# EAGLE design STM32_DAC (EAGLE 9.6.2)

## Sheet 1 of 2
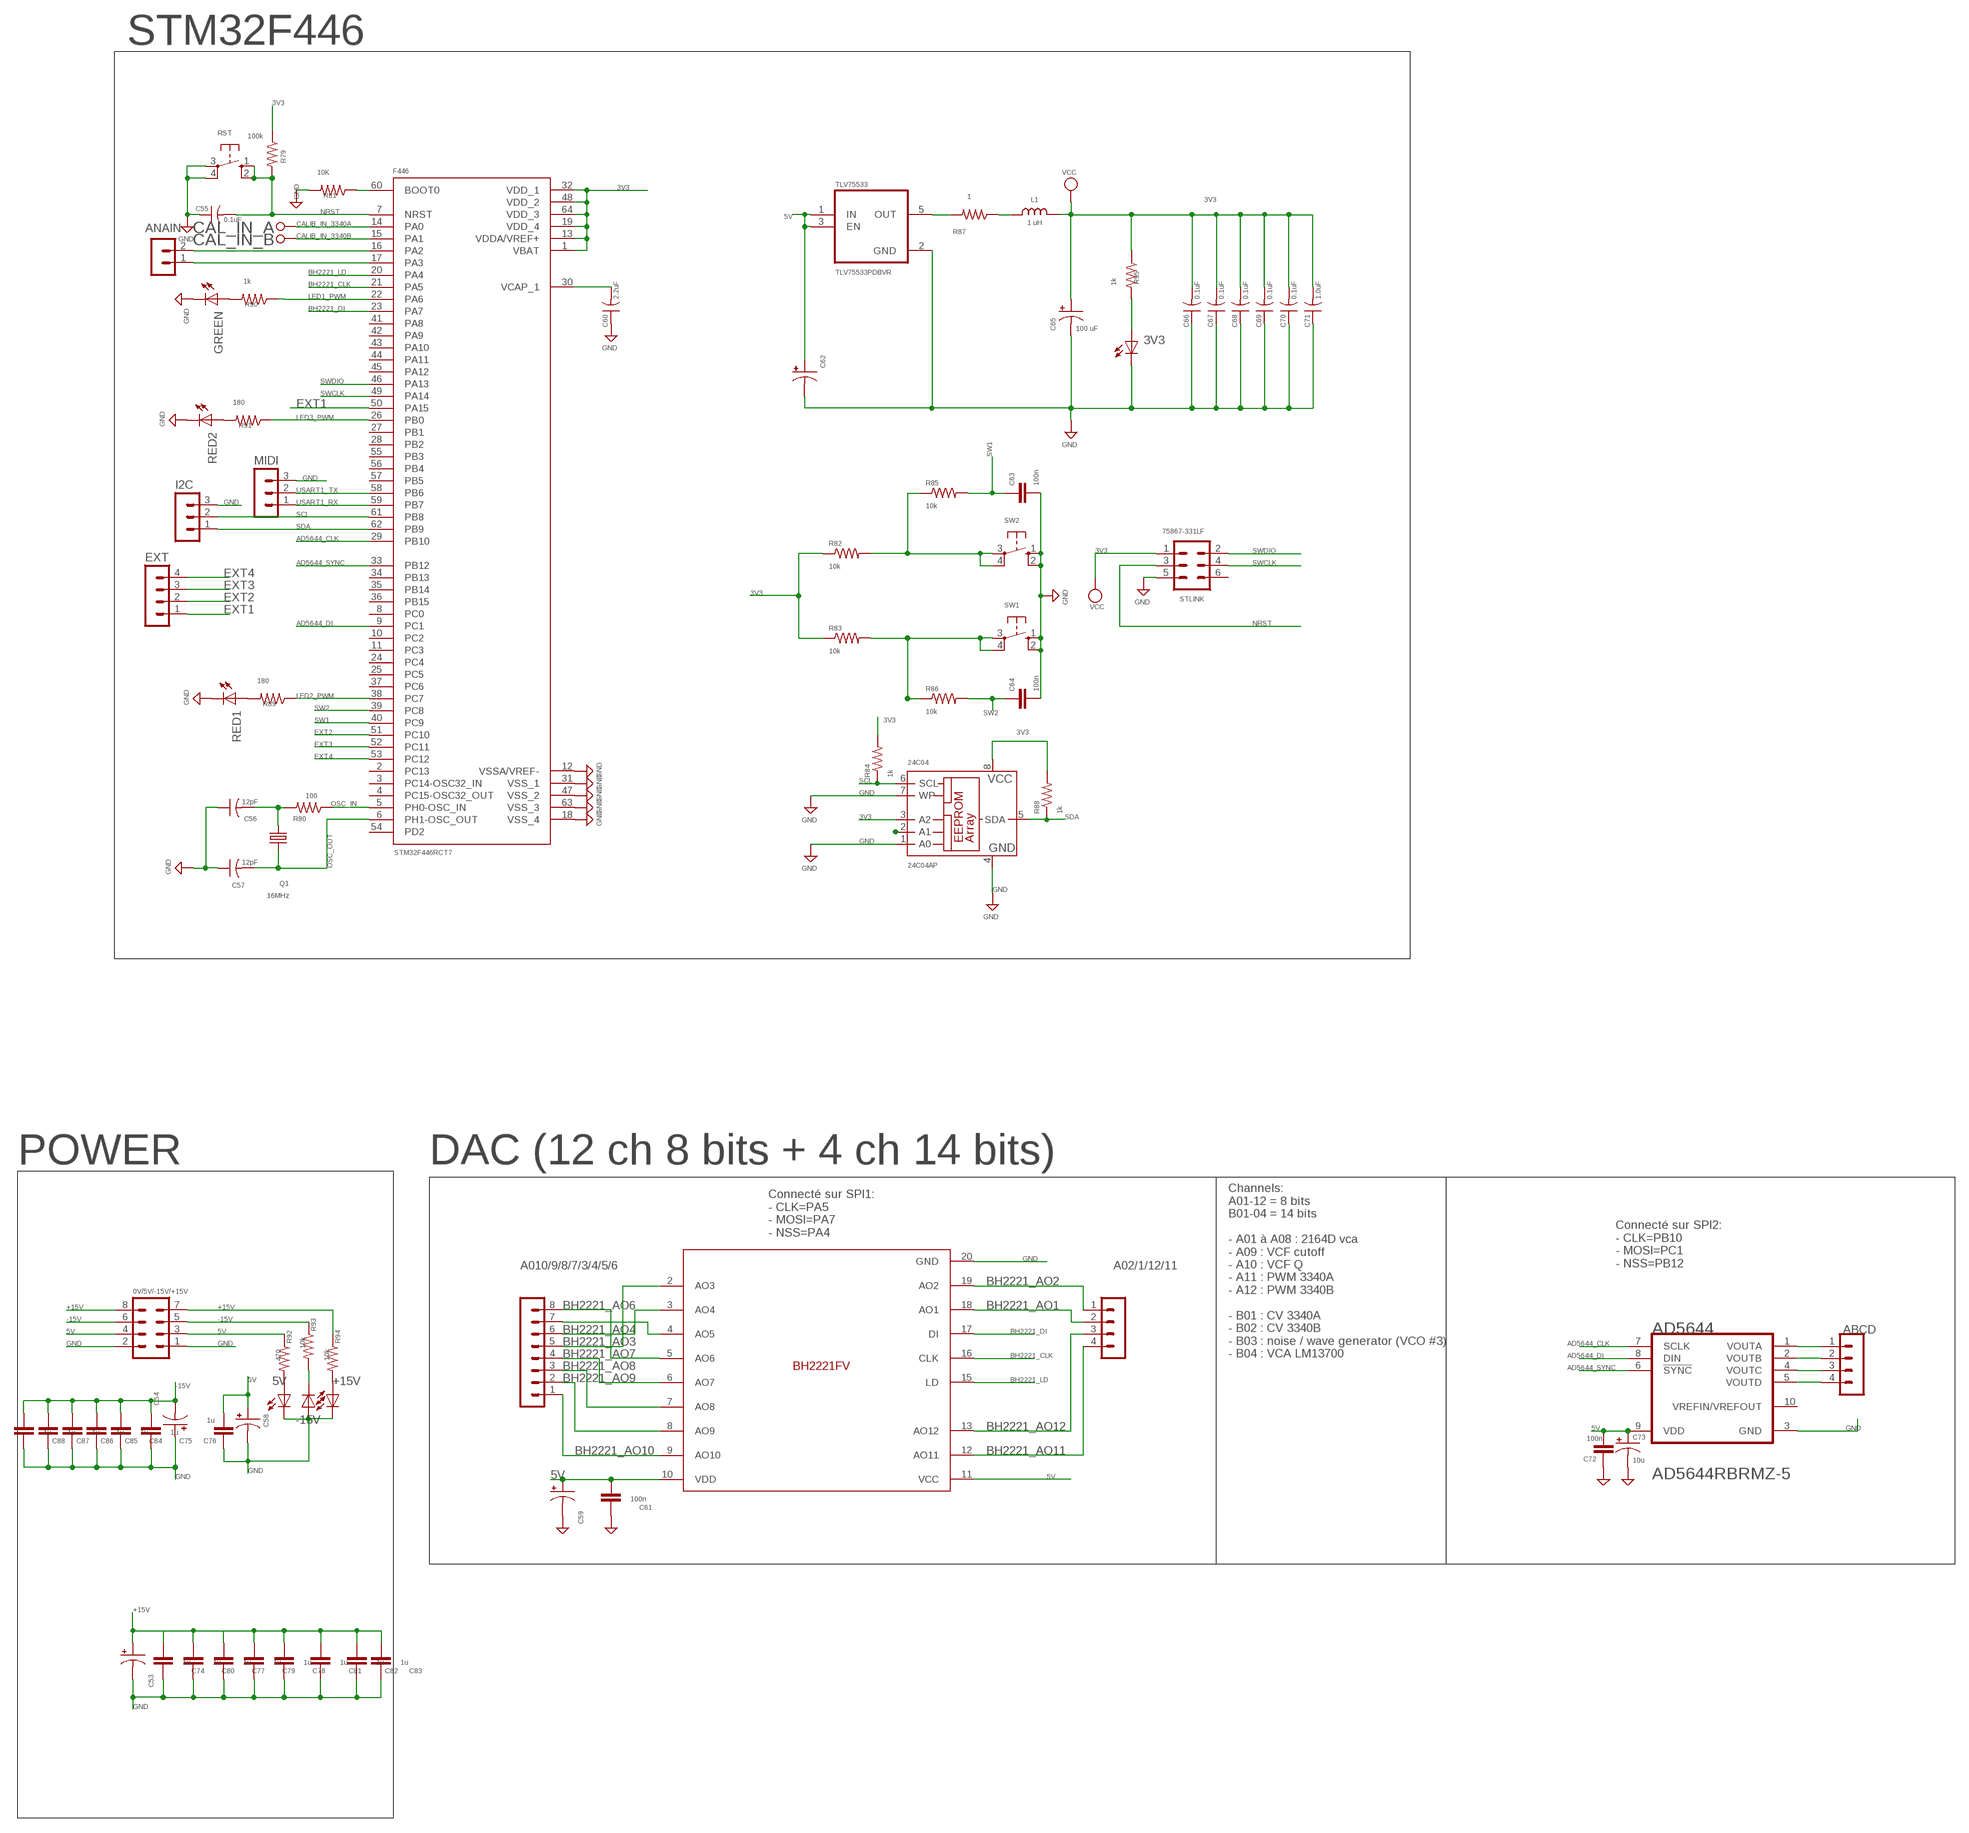
[diagram p0: schematic, sheet 1]

### Parts
0V/5V/-15V/+15V  MA04-2  [MA04-2]
3V3  LED-0805  [0805-LED]
5V  LED-0603  [0603-LED]
24C04  24C04AP  [DIL8]
+15V  LED-0805  [0805-LED]
-15V  LED-0805  [0805-LED]
A02/1/12/11  MA04-1  [MA04-1]
A010/9/8/7/3/4/5/6  MA08-1  [MA08-1]
ABCD  MA04-1  [MA04-1]
AD5644  ANALOG_DEVICES_AD5644RBRMZ-5ANALOG_DEVICES_AD5644RBRMZ-5_0_0  [ANALOG_DEVICES_AD5644RBRMZ-5_0]
ANAIN  MA02-1  [MA02-1]
BH2221  BH2221FV  [SOP65P780X200-20N]
C53  10u  CPOL-US2917  [CPOL2917]
C54  10u  CPOL-US2917  [CPOL2917]
C55  0.1uF  C-US0805  [C0805]
C56  12pF  C-US0805  [C0805]
C57  12pF  C-US0805  [C0805]
C58  10u  CPOL-US2917  [CPOL2917]
C59  10u  CPOL-US2917  [CPOL2917]
C60  2.2uF  C-US0805  [C0805]
C61  100n  C-EUC1206  [C1206]
C62  10u  CPOL-US2917  [CPOL2917]
C63  100n  C-EUC0805  [C0805]
C64  100n  C-EUC0805  [C0805]
C65  100 uF  CPOL-US2917  [CPOL2917]
C66  0.1uF  C-US0805  [C0805]
C67  0.1uF  C-US0805  [C0805]
C68  0.1uF  C-US0805  [C0805]
C69  0.1uF  C-US0805  [C0805]
C70  0.1uF  C-US0805  [C0805]
C71  1.0uF  C-US0805  [C0805]
C72  100n  C-EUC1206  [C1206]
C73  10u  CPOL-US2917  [CPOL2917]
C74  1u  C-EUC1206  [C1206]
C75  1u  C-EUC1206  [C1206]
C76  1u  C-EUC1206  [C1206]
C77  1u  C-EUC1206  [C1206]
C78  1u  C-EUC1206  [C1206]
C79  1u  C-EUC1206  [C1206]
C80  1u  C-EUC1206  [C1206]
C81  1u  C-EUC1206  [C1206]
C82  1u  C-EUC1206  [C1206]
C83  1u  C-EUC1206  [C1206]
C84  1u  C-EUC1206  [C1206]
C85  1u  C-EUC1206  [C1206]
C86  1u  C-EUC1206  [C1206]
C87  1u  C-EUC1206  [C1206]
C88  1u  C-EUC1206  [C1206]
CAL_IN_A  TESTPOINT  [TESTPOINT_63]
CAL_IN_B  TESTPOINT  [TESTPOINT_63]
EXT  MA04-1  [MA04-1]
F446  STM32F446RCT7  [QFP50P1200X1200X160-64N]
GREEN  LED-0805  [0805-LED]
I2C  MA03-1  [MA03-1]
L1  1 uH  L-USL0805  [L0805]
MIDI  MA03-1  [MA03-1]
Q1  16MHz  Q-HSEHC-46X  [Q-HC-46X]
R79  100k  R-US0805  [R0805]
R80  100  R-US0805  [R0805]
R81  10K  R-US0805  [R0805]
R82  10k  R-US_R0805  [R0805]
R83  10k  R-US_R0805  [R0805]
R84  1k  R-US_R0805  [R0805]
R85  10k  R-US_R0805  [R0805]
R86  10k  R-US_R0805  [R0805]
R87  1  R-US0805  [R0805]
R88  1k  R-US_R0805  [R0805]
R89  180  R-US0805  [R0805]
R90  1k  R-US0805  [R0805]
R91  180  R-US0805  [R0805]
R92  470  R-US0805  [R0805]
R93  10k  R-US0805  [R0805]
R94  10k  R-US0805  [R0805]
R95  1k  R-US0805  [R0805]
RED1  LED-0603  [0603-LED]
RED2  LED-0603  [0603-LED]
RST  10-XX  [B3F-10XX]
STLINK  75867-331LF  MA03-2  [MA03-2]
SW1  10-XX  [B3F-10XX]
SW2  10-XX  [B3F-10XX]
TLV75533  TLV75533PDBVR  [SOT95P280X145-5N]

### Nets
3V3: 24C04.2(A1) 24C04.3(A2) 24C04.8(VCC) C65.+ C66.2 C67.2 C68.2 C69.2 C70.2 C71.2 F446.1(VBAT) F446.13(VDDA/VREF+) F446.19(VDD_4) F446.32(VDD_1) F446.48(VDD_2) F446.64(VDD_3) L1.2 R79.1 R82.1 R83.1 R84.2 R88.2 R95.1 STLINK.1 ; supply symbol labelled VCC
5V: 0V/5V/-15V/+15V.3 0V/5V/-15V/+15V.4 AD5644.9(VDD) BH2221.10(VDD) BH2221.11(VCC) C58.+ C59.+ C61.2 C62.+ C72.2 C73.+ C76.2 R92.1 TLV75533.1(IN) TLV75533.3(EN)
+15V: 0V/5V/-15V/+15V.7 0V/5V/-15V/+15V.8 C53.+ C74.2 C77.2 C78.2 C79.2 C80.2 C81.2 C82.2 C83.2 R94.1
-15V: 0V/5V/-15V/+15V.5 0V/5V/-15V/+15V.6 C54.- C75.2 C84.2 C85.2 C86.2 C87.2 C88.2 R93.1
AD5644_CLK: AD5644.7(SCLK) F446.29(PB10)
AD5644_DI: AD5644.8(DIN) F446.9(PC1)
AD5644_SYNC: AD5644.6(!SYNC!) F446.33(PB12)
BH2221_AO1: A02/1/12/11.2 BH2221.18(AO1)
BH2221_AO2: A02/1/12/11.1 BH2221.19(AO2)
BH2221_AO3: A010/9/8/7/3/4/5/6.5 BH2221.2(AO3)
BH2221_AO4: A010/9/8/7/3/4/5/6.6 BH2221.3(AO4)
BH2221_AO6: A010/9/8/7/3/4/5/6.8 BH2221.5(AO6)
BH2221_AO7: A010/9/8/7/3/4/5/6.4 BH2221.6(AO7)
BH2221_AO8: A010/9/8/7/3/4/5/6.3 BH2221.7(AO8)
BH2221_AO9: A010/9/8/7/3/4/5/6.2 BH2221.8(AO9)
BH2221_AO10: A010/9/8/7/3/4/5/6.1 BH2221.9(AO10)
BH2221_AO11: A02/1/12/11.4 BH2221.12(AO11)
BH2221_AO12: A02/1/12/11.3 BH2221.13(AO12)
BH2221_CLK: BH2221.16(CLK) F446.21(PA5)
BH2221_DI: BH2221.17(DI) F446.23(PA7)
BH2221_LD: BH2221.15(LD) F446.20(PA4)
BOOT1: F446.60(BOOT0) R81.1
CALIB_IN_3340A: CAL_IN_A.P$1 F446.14(PA0)
CALIB_IN_3340B: CAL_IN_B.P$1 F446.15(PA1)
EXT1: EXT.1 F446.50(PA15)
EXT2: EXT.2 F446.51(PC10)
EXT3: EXT.3 F446.52(PC11)
EXT4: EXT.4 F446.53(PC12)
GND: 0V/5V/-15V/+15V.1 0V/5V/-15V/+15V.2 3V3.C 5V.C 24C04.1(A0) 24C04.4(GND) 24C04.7(WP) +15V.C -15V.A AD5644.3(GND) BH2221.20(GND) C53.- C54.+ C55.1 C56.1 C57.1 C58.- C59.- C60.1 C61.1 C62.- C63.2 C64.2 C65.- C66.1 C67.1 C68.1 C69.1 C70.1 C71.1 C72.1 C73.- C74.1 C75.1 C76.1 C77.1 C78.1 C79.1 C80.1 C81.1 C82.1 C83.1 C84.1 C85.1 C86.1 C87.1 C88.1 F446.12(VSSA/VREF-) F446.18(VSS_4) F446.31(VSS_1) F446.47(VSS_2) F446.63(VSS_3) GREEN.C I2C.3 MIDI.3 R81.2 RED1.C RED2.C RST.3(P) RST.4(P1) STLINK.5 SW1.1(S) SW1.2(S1) SW2.1(S) SW2.2(S1) TLV75533.2(GND)
LED1_PWM: F446.22(PA6) R90.1
LED2_PWM: F446.38(PC7) R89.1
LED3_PWM: F446.26(PB0) R91.1
N$5: R82.2 R85.1 SW2.3(P) SW2.4(P1)
N$7: R83.2 R86.1 SW1.3(P) SW1.4(P1)
N$23: A010/9/8/7/3/4/5/6.7 BH2221.4(AO5)
N$34: ABCD.1 AD5644.1(VOUTA)
N$35: ABCD.2 AD5644.2(VOUTB)
N$39: ABCD.3 AD5644.4(VOUTC)
N$40: ABCD.4 AD5644.5(VOUTD)
N$48: R89.2 RED1.A
N$52: R91.2 RED2.A
N$53: 5V.A R92.2
N$54: -15V.C R93.2
N$55: +15V.A R94.2
N$56: GREEN.A R90.2
N$57: 3V3.A R95.2
N$58: ANAIN.2 F446.16(PA2)
N$59: ANAIN.1 F446.17(PA3)
N$104: C56.2 Q1.1 R80.2
N$108: R87.2 TLV75533.5(OUT)
N$109: L1.1 R87.1
NRST: C55.2 F446.7(NRST) R79.2 RST.1(S) RST.2(S1) STLINK.3
OSC_IN: F446.5(PH0-OSC_IN) R80.1
OSC_OUT: C57.2 F446.6(PH1-OSC_OUT) Q1.2
SCL: 24C04.6(SCL) F446.61(PB8) I2C.2 R84.1
SDA: 24C04.5(SDA) F446.62(PB9) I2C.1 R88.1
SW1: C63.1 F446.40(PC9) R85.2
SW2: C64.1 F446.39(PC8) R86.2
SWCLK: F446.49(PA14) STLINK.4
SWDIO: F446.46(PA13) STLINK.2
USART1_RX: F446.59(PB7) MIDI.1
USART1_TX: F446.58(PB6) MIDI.2
VCAP1: C60.2 F446.30(VCAP_1)
Unconnected: AD5644.10(VREFIN/VREFOUT) F446.2(PC13) F446.3(PC14-OSC32_IN) F446.4(PC15-OSC32_OUT) F446.8(PC0) F446.10(PC2) F446.11(PC3) F446.24(PC4) F446.25(PC5) F446.27(PB1) F446.28(PB2) F446.34(PB13) F446.35(PB14) F446.36(PB15) F446.37(PC6) F446.41(PA8) F446.42(PA9) F446.43(PA10) F446.44(PA11) F446.45(PA12) F446.54(PD2) F446.55(PB3) F446.56(PB4) F446.57(PB5) STLINK.6

### Notes on the sheet
- STM32F446
- POWER | DAC (12 ch 8 bits + 4 ch 14 bits)
- Connecté sur SPI1: 
  - CLK=PA5
  - MOSI=PA7
  - NSS=PA4
- Connecté sur SPI2: 
  - CLK=PB10
  - MOSI=PC1
  - NSS=PB12
- Channels:
  A01-12 = 8 bits
  B01-04 = 14 bits
  
  - A01 à A08 : 2164D vca
  - A09 : VCF cutoff
  - A10 : VCF Q
  - A11 : PWM 3340A
  - A12 : PWM 3340B
  
  - B01 : CV 3340A
  - B02 : CV 3340B
  - B03 : noise / wave generator (VCO #3)
  - B04 : VCA LM13700

## Sheet 2 of 2

## Library data of the parts
0V/5V/-15V/+15V = con-lstb:MA04-2: PIN HEADER; OC_FARNELL: unknown; OC_NEWARK: unknown
3V3 5V +15V -15V GREEN RED1 RED2 = Passives:LED
24C04 = microchip:24*: Serial EEPROM I2C; MF: RAMTRON INTERNATIONAL CORP; MPN: FM24C04A-P; OC_FARNELL: 1094258; OC_NEWARK: 97H6447
A02/1/12/11 ABCD EXT = con-lstb:MA04-1: PIN HEADER; OC_FARNELL: unknown; OC_NEWARK: unknown
A010/9/8/7/3/4/5/6 = con-lstb:MA08-1: PIN HEADER; OC_FARNELL: unknown; OC_NEWARK: unknown
AD5644 = Analog Devices - AD5644RBRMZ-5:ANALOG_DEVICES_AD5644RBRMZ-5: ADI-AD5644R-RM-10; CIIVA_IDS: 963927; COMPONENT_LINK_1_DESCRIPTION: Manufacturer URL; COMPONENT_LINK_1_URL: http://www.analog.com/en/index.html; COMPONENT_LINK_3_DESCRIPTION: Package Specification; COMPONENT_LINK_3_URL: http://www.analog.com/static/imported-files/packages/PKG_PDF/MSOP%28RM%29/RM_10.pdf; COMPONENT_LINK_4_DESCRIPTION: Product URL; COMPONENT_LINK_4_URL: http://www.analog.com/en/digital-to-analog-converters/da-converters/ad5644r/products/product.html; DAC_OUTPUTS: 4; DATASHEET: http://www.analog.com/static/imported-files/data_sheets/AD5624R_5644R_5664R.pdf; DATASHEET_VERSION: Rev.B; FOOTPRINT_VARIANT_NAME_0: Level C; FOOTPRINT_VARIANT_NAME_1: Level B; FOOTPRINT_VARIANT_NAME_2: Level A; IMPORTED: yes; IMPORTED_FROM: vault; IMPORT_TS: 1521855052; MAX_V: 5.5V; MF: Analog Devices; MOUNTING_TECHNOLOGY: Surface Mount; MPN: AD5644RBRMZ-5; OP_PWR_DISS: 6.6mW; PACKAGE: RM-10; PACKAGE_DESCRIPTION: 10-Lead Mini Small Outline Package [MSOP]; PACKAGE_VERSION: May-2005; PACKING: Tube; PIN_0_0_6_INSIDE_EDGE: clock; PREFIX: U; RELEASE_DATE: 1387041291; RESOLUTION_BITS: 14; ROHS: Yes; SETTLING_TIME: 3.5Âμs; SINGLE_SUPPLY: Yes; VAULT_GUID: 80AB4FD1-89D4-49BA-A3F3-5D59DB24CB1A; VAULT_REVISION: 6F701BB3-0F34-4771-8D13-1575DC664D0F
ANAIN = stm32_pi_board:MA02-1: Headers & Wire Housing, 1 Row, 3 Position
BH2221 = BH2221FV:BH2221FV
C53 C54 C58 C59 C62 C65 C73 = MyComponents:CPOL-US: SMT Tantalum Capacitor; MOUSER: 581-TPSE477K010R0200
C55-C57 C60 C66-C71 = MyComponents:C-US: SMD Multilayer Ceramic Capacitor; MOUSER: 80-C0805C104J5RAUTO
C61 C72 C74-C88 = rcl:C-EU: CAPACITOR, European symbol; SPICEPREFIX: C
C63 C64 = 6P1_EVB:C-EU: CAPACITOR, European symbol
CAL_IN_A CAL_IN_B = 6P1_EVB:TESTPOINT
F446 = STM32F446RCT7:STM32F446RCT7: 32 Bit Microcontroller, High Performance, ARM Cortex-M4, 180 MHz, 256 KB, 128 KB, 64, LQFP; AVAILABILITY: Unavailable; DESCRIPTION: ARM® Cortex®-M4 STM32F4 Microcontroller IC 32-Bit 180MHz 256KB (256K x 8) FLASH 64-LQFP (10x10); DIGIKEY-PURCHASE-URL: https://snapeda.com/shop?store=DigiKey&id=703054; MF: STMicroelectronics; MP: STM32F446RCT7; PACKAGE: LQFP-64 STMicroelectronics; PRICE: None
I2C MIDI = con-lstb:MA03-1: PIN HEADER; OC_FARNELL: unknown; OC_NEWARK: unknown
L1 = MyComponents:L-US: SMD Ferrite Bead; MOUSER: 963-CKP2012N1R0M-T
Q1 = MyComponents:Q-HSE: HSE SMD Crystal; MOUSER: 520-160-20-46X
R79-R81 R87 R89-R95 = MyComponents:R-US: SMD Resistor; MOUSER: 660-RK73H2ATTDD1R00F
R82-R86 R88 = 6P1_EVB:R-US_: RESISTOR, American symbol
RST SW1 SW2 = switch-omron:10-XX: OMRON SWITCH; MPN: B3F-1000; OC_FARNELL: 176432; OC_NEWARK: 36M3542
STLINK = MyComponents:MA03-2: Headers & Wire Housing, 2 Row, 6 Position; MOUSER: 649-75867-331LF
TLV75533 = TLV75533PDBVR:TLV75533PDBVR: 500mA Low-IQ Small-Size Low-Dropout (LDO) Regulator 5-SOT-23 -40 to 125; AVAILABILITY: Unavailable; DESCRIPTION: Linear Voltage Regulator IC 1 Output 500mA SOT-23-5; MF: Texas Instruments; MP: TLV75533PDBVR; PACKAGE: SOT-23 Texas Instruments; PRICE: None

## Board
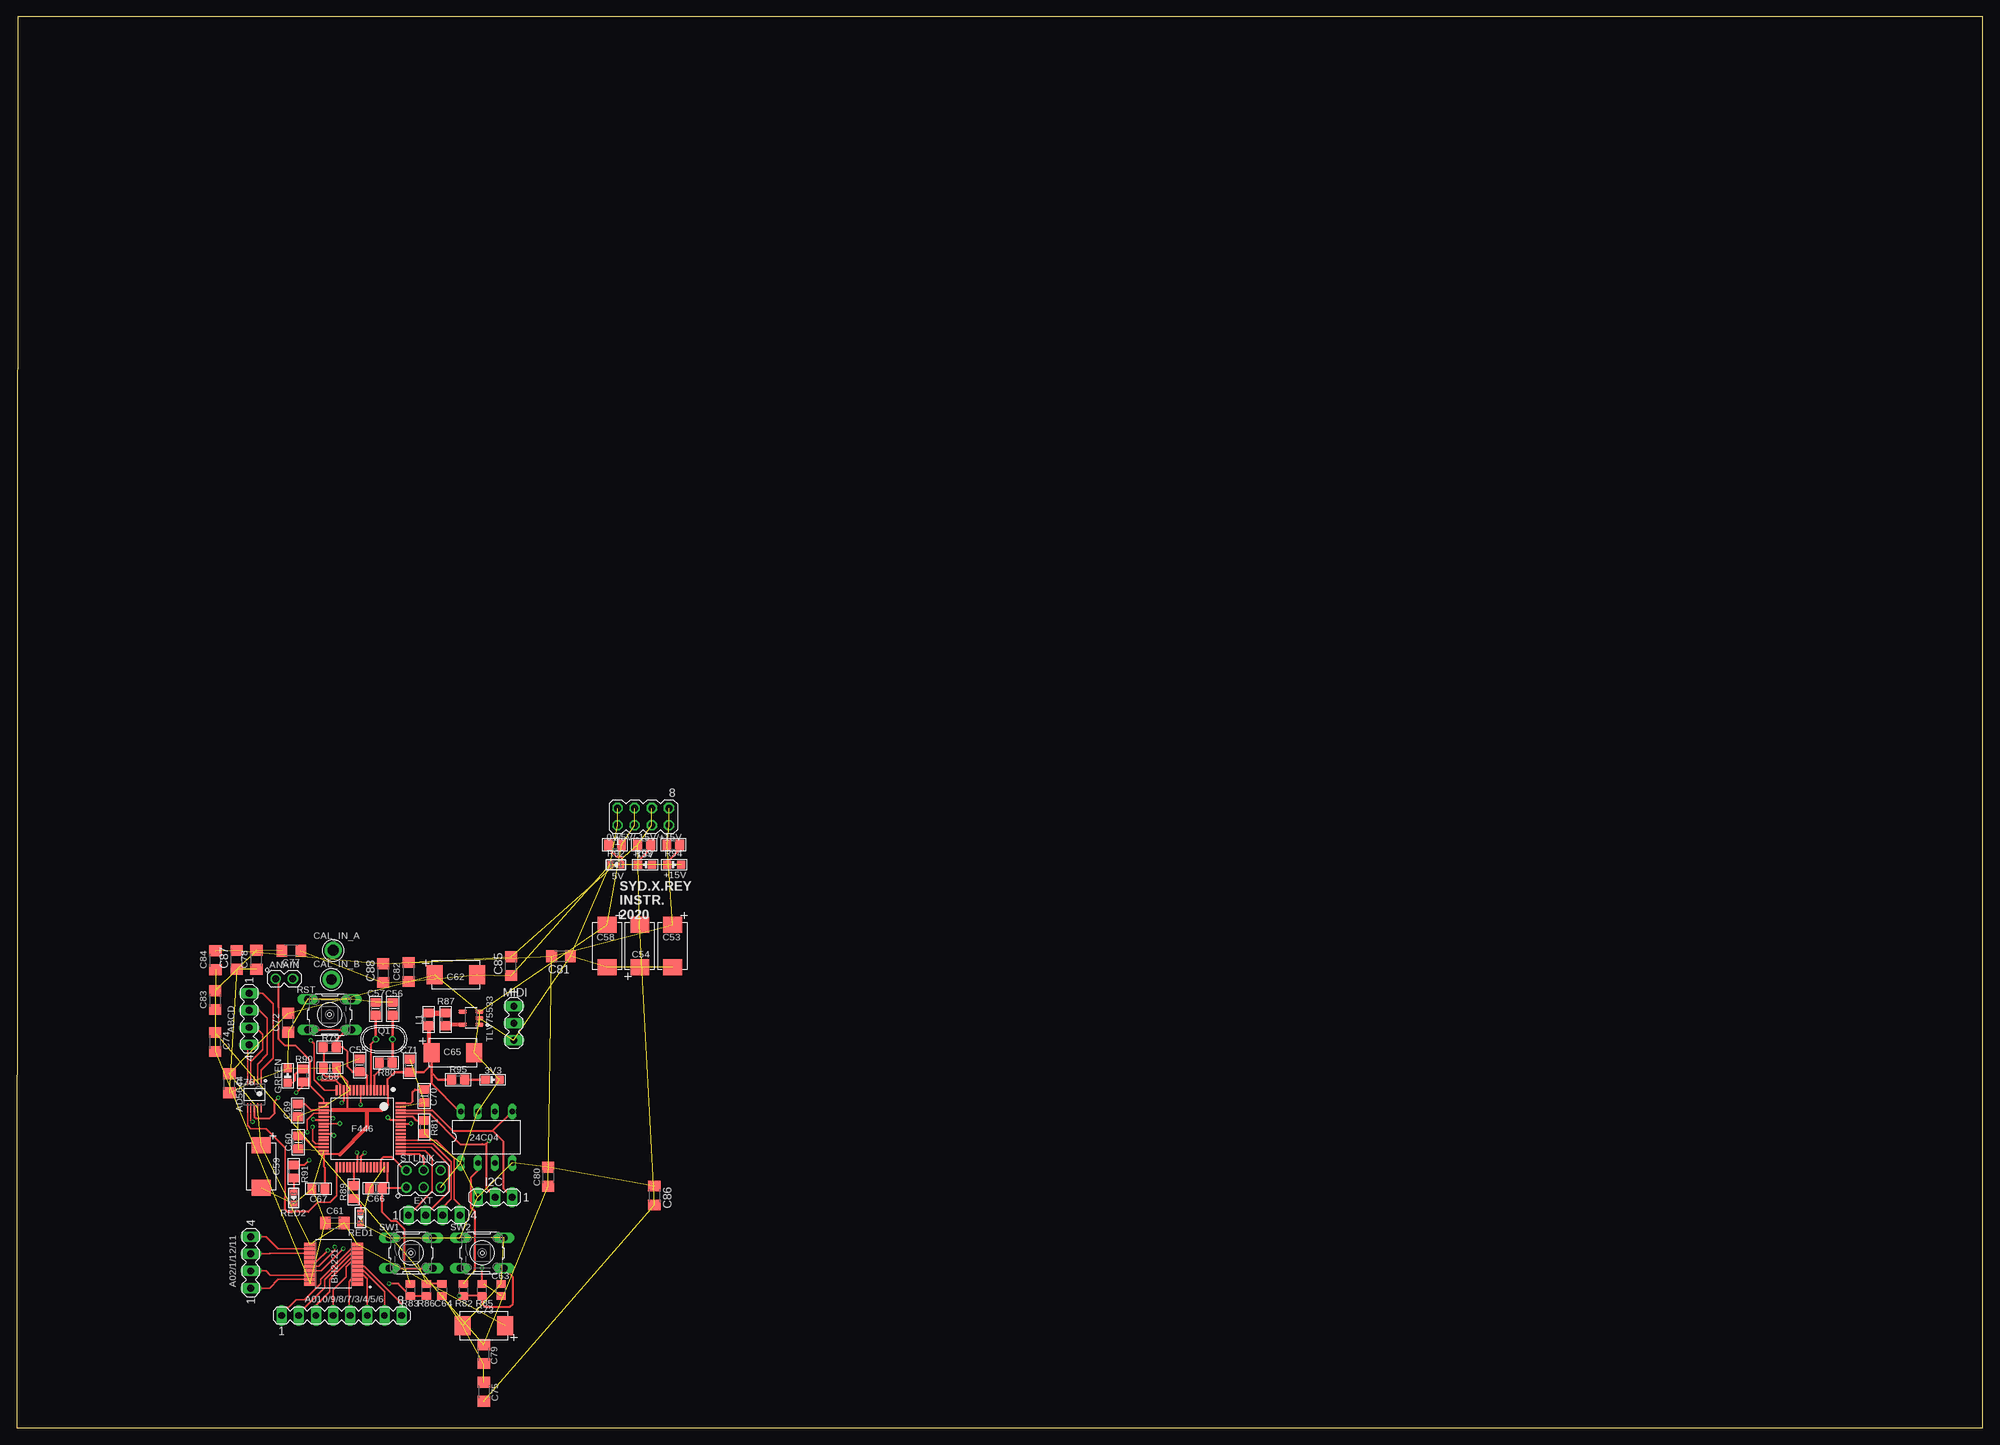
[diagram p1: board, top side]
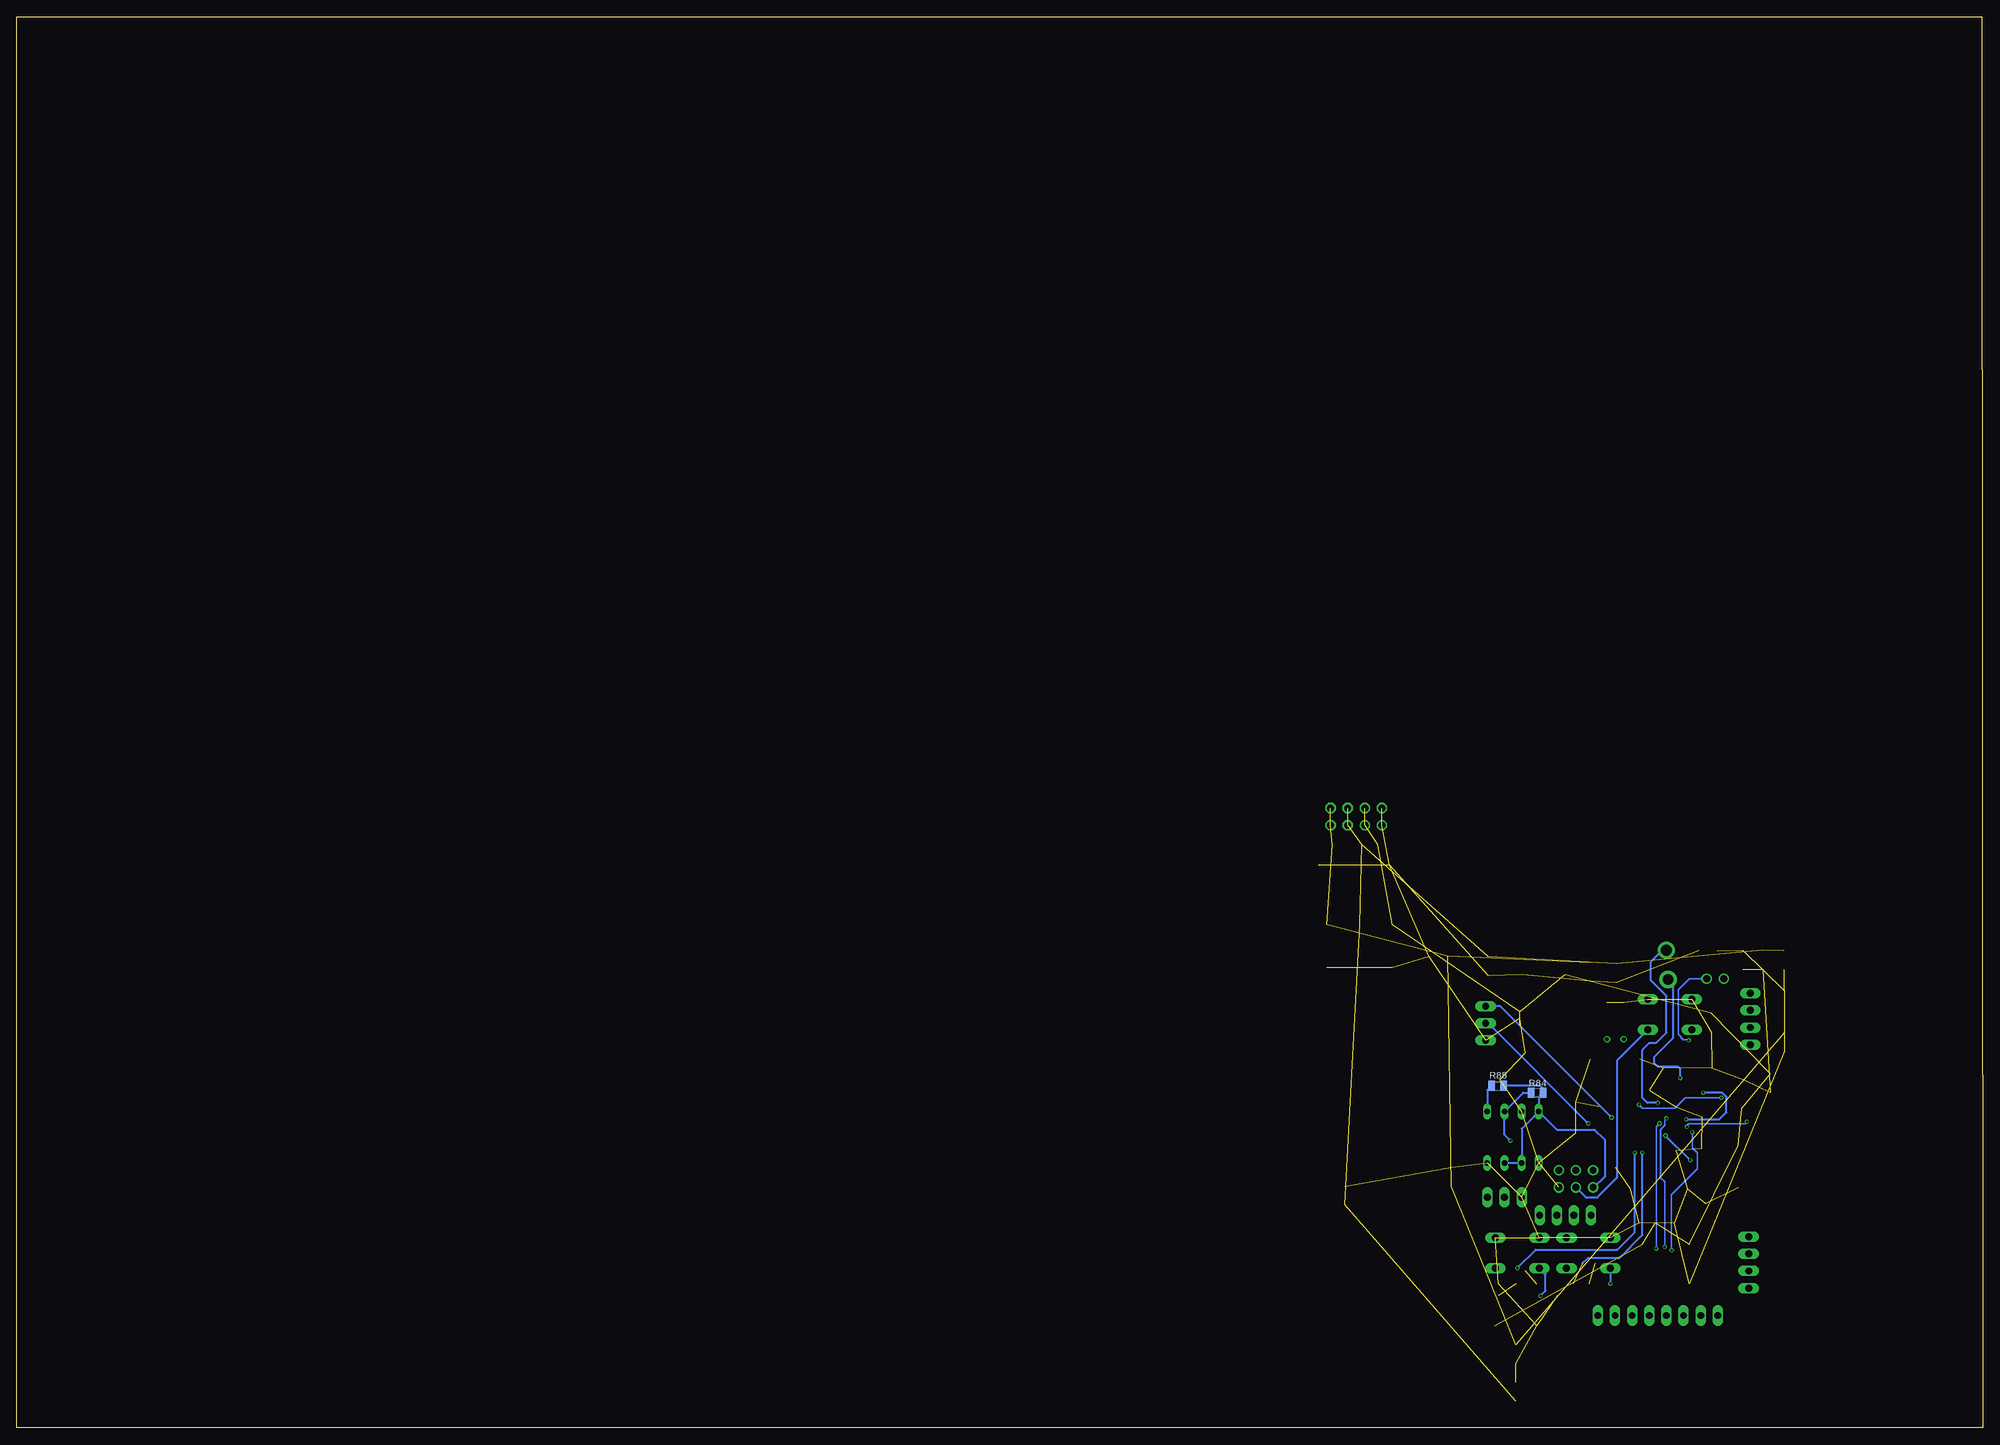
[diagram p2: board, bottom side, seen from below]

Size 291.35 x 209.06 mm. Coordinates in mm from the lower left corner, seen from the top.
Outline: 0,0 291.35,0 291.35,209.06 0.13,209.06 0,0
Copper layers (1*16): Top 0.018mm / dielectric 1.55mm / Bottom 0.018mm
Design rules "eC_2Layer_PClass6_BaseCopperO18_eCDefault": minimum track width 0.15mm, minimum drill 0.35mm, track to track 0.15mm, track to pad 0.15mm, pad to pad 0.15mm, via to via 0.15mm, smd to smd 0mil, copper to edge 0.25mm, drill to drill 0.35mm, minimum pad ring 0.175mm, minimum via ring 0.125mm, stop-mask expansion 0mil, vias tented up to drill 0.45mm, thermal gap 0.2mm

### Footprints (pad centres in the part's own frame; a part is rotated, then mirrored left to right if it is on the bottom)
MA04-2 = drill 1.016 octagon: 1 -3.81,-1.27; 2 -3.81,1.27; 3 -1.27,-1.27; 4 -1.27,1.27; 5 1.27,-1.27; 6 1.27,1.27; 7 3.81,-1.27; 8 3.81,1.27
0805-LED = smd 1.2 x 1.2: A -1.05,0; C 1.05,0
0603-LED = smd 0.8 x 1: A 0.825,0; C -0.825,0
DIL8 = drill 0.813 long: 1 -3.81,-3.81; 2 -1.27,-3.81; 3 1.27,-3.81; 4 3.81,-3.81; 5 3.81,3.81; 6 1.27,3.81; 7 -1.27,3.81; 8 -3.81,3.81
MA04-1 = drill 1.016 long: 1 -3.81,0; 2 -1.27,0; 3 1.27,0; 4 3.81,0
MA08-1 = drill 1.016 long: 1 -8.89,0; 2 -6.35,0; 3 -3.81,0; 4 -1.27,0; 5 1.27,0; 6 3.81,0; 7 6.35,0; 8 8.89,0
ANALOG_DEVICES_AD5644RBRMZ-5_0 = smd 1.45 x 0.25: 1 -2.025,1; 2 -2.025,0.5; 3 -2.025,0; 4 -2.025,-0.5; 5 -2.025,-1; 6 2.025,-1; 7 2.025,-0.5; 8 2.025,0; 9 2.025,0.5; 10 2.025,1
MA02-1 = drill 1.016: 1 -2.54,0; 2 0,0
SOP65P780X200-20N = smd 1.9 x 0.48: 1 -3.505,2.925; 2 -3.505,2.275; 3 -3.505,1.625; 4 -3.505,0.975; 5 -3.505,0.325; 6 -3.505,-0.325; 7 -3.505,-0.975; 8 -3.505,-1.625; 9 -3.505,-2.275; 10 -3.505,-2.925; 11 3.505,-2.925; 12 3.505,-2.275; 13 3.505,-1.625; 14 3.505,-0.975; 15 3.505,-0.325; 16 3.505,0.325; 17 3.505,0.975; 18 3.505,1.625; 19 3.505,2.275; 20 3.505,2.925
CPOL2917 = smd 2.4 x 2.8: + -3.15,0; - 3.15,0
C0805 = smd 1.3 x 1.5: 1 -0.95,0; 2 0.95,0
C1206 = smd 1.6 x 1.8: 1 -1.4,0; 2 1.4,0
C0805' = smd 1.016 x 1.422: 1 -0.889,0; 2 0.889,0
TESTPOINT_63 = drill 1.6 pad 2.54: P$1 0,0
QFP50P1200X1200X160-64N = smd 1.5 x 0.3: 1 -5.7,3.75; 2 -5.7,3.25; 3 -5.7,2.75; 4 -5.7,2.25; 5 -5.7,1.75; 6 -5.7,1.25; 7 -5.7,0.75; 8 -5.7,0.25; 9 -5.7,-0.25; 10 -5.7,-0.75; 11 -5.7,-1.25; 12 -5.7,-1.75; 13 -5.7,-2.25; 14 -5.7,-2.75; 15 -5.7,-3.25; 16 -5.7,-3.75; 33 5.7,-3.75; 34 5.7,-3.25; 35 5.7,-2.75; 36 5.7,-2.25; 37 5.7,-1.75; 38 5.7,-1.25; 39 5.7,-0.75; 40 5.7,-0.25; 41 5.7,0.25; 42 5.7,0.75; 43 5.7,1.25; 44 5.7,1.75; 45 5.7,2.25; 46 5.7,2.75; 47 5.7,3.25; 48 5.7,3.75 | smd 0.3 x 1.5: 17 -3.75,-5.7; 18 -3.25,-5.7; 19 -2.75,-5.7; 20 -2.25,-5.7; 21 -1.75,-5.7; 22 -1.25,-5.7; 23 -0.75,-5.7; 24 -0.25,-5.7; 25 0.25,-5.7; 26 0.75,-5.7; 27 1.25,-5.7; 28 1.75,-5.7; 29 2.25,-5.7; 30 2.75,-5.7; 31 3.25,-5.7; 32 3.75,-5.7; 49 3.75,5.7; 50 3.25,5.7; 51 2.75,5.7; 52 2.25,5.7; 53 1.75,5.7; 54 1.25,5.7; 55 0.75,5.7; 56 0.25,5.7; 57 -0.25,5.7; 58 -0.75,5.7; 59 -1.25,5.7; 60 -1.75,5.7; 61 -2.25,5.7; 62 -2.75,5.7; 63 -3.25,5.7; 64 -3.75,5.7
MA03-1 = drill 1.016 long: 1 -2.54,0; 2 0,0; 3 2.54,0
L0805 = smd 1.3 x 1.5: 1 -0.95,0; 2 0.95,0
Q-HC-46X = drill 0.61: 1 -1.25,0; 2 1.25,0
R0805 = smd 1.3 x 1.5: 1 -0.95,0; 2 0.95,0
R0805' = smd 1.016 x 1.422: 1 -0.889,0; 2 0.889,0
B3F-10XX = drill 1.016 long: 1 -3.251,2.261; 2 3.251,2.261; 3 -3.251,-2.261; 4 3.251,-2.261
MA03-2 = drill 1.016: 1 -2.54,-1.27; 2 -2.54,1.27; 3 0,-1.27; 4 0,1.27; 5 2.54,-1.27; 6 2.54,1.27
SOT95P280X145-5N = smd 1.21 x 0.59: 1 -1.255,0.95; 2 -1.255,0; 3 -1.255,-0.95; 4 1.255,-0.95; 5 1.255,0.95

### Placement (x,y rotation side)
0V/5V/-15V/+15V  92.84,90.55 0 top
3V3  70.48,51.56 0 top
5V  88.77,83.44 0 top
24C04  69.6,43.05 0 top
+15V  97.41,83.44 0 top
-15V  93.09,83.44 180 top
A02/1/12/11  34.67,24.51 90 top
A010/9/8/7/3/4/5/6  48.13,16.64 0 top
ABCD  34.42,60.58 270 top
AD5644  35.18,49.4 270 top
ANAIN  40.89,66.55 0 top
BH2221  46.96,24.26 180 top
C53  97.16,71.41 270 top
C54  92.33,71.41 90 top
C55  50.78,53.7 270 top
C56  55.69,62.07 270 top
C57  53.19,62.07 270 top
C58  87.5,71.41 270 top
C59  36.2,38.73 270 top
C60  41.68,42.3 90 top
C61  47.12,30.35 0 top
C62  65.08,67.12 0 top
C63  100n  [C0805']  71.75,20.45 90 top
C64  100n  [C0805']  63,20.45 270 top
C65  64.61,55.57 0 top
C66  53.2,35.53 0 top
C67  44.69,35.45 0 top
C68  46.4,53.36 180 top
C69  41.6,47.02 90 top
C70  60.38,49.16 90 top
C71  58.24,53.64 270 top
C72  40.19,60 90 top
C73  69.21,15.11 180 top
C74  29.41,57.16 90 top
C75  69.21,5.33 270 top
C76  31.5,51.05 90 top
C77  40.69,70.7 180 top
C78  35.51,69.34 90 top
C79  69.21,10.92 90 top
C80  78.74,37.21 270 top
C81  80.64,69.85 180 top
C82  58.08,67.54 90 top
C83  29.42,63.37 90 top
C84  29.44,69.29 90 top
C85  73.23,68.42 90 top
C86  94.49,34.42 270 top
C87  32.58,69.32 90 top
C88  54.3,67.37 90 top
CAL_IN_A  46.86,70.74 0 top
CAL_IN_B  46.61,66.42 0 top
EXT  61.85,31.5 0 top
F446  51.18,44.32 270 top
GREEN  40.13,52.2 90 top
I2C  70.87,34.16 180 top
L1  61.06,60.5 270 top
MIDI  73.66,59.94 270 top
Q1  54.44,57.57 180 top
R79  46.36,56.39 0 top
R80  54.69,54.07 0 top
R81  60.37,44.57 270 top
R82  10k  [R0805']  66.17,20.45 270 top
R83  10k  [R0805']  58.32,20.45 270 top
R84  1k  [R0805']  66.04,49.66 0 bottom
R85  10k  [R0805']  68.96,20.45 90 top
R86  10k  [R0805']  60.71,20.45 90 top
R87  63.56,60.5 270 top
R88  1k  [R0805']  71.88,50.67 0 bottom
R89  49.91,34.92 270 top
R90  42.42,52.2 90 top
R91  41.02,37.97 270 top
R92  88.65,86.36 180 top
R93  92.96,86.36 0 top
R94  97.28,86.36 0 top
R95  65.41,51.56 0 top
RED1  50.93,31.12 90 top
RED2  41.02,34.04 90 top
RST  46.36,61.21 180 top
STLINK  60.27,36.89 0 top
SW1  58.42,25.91 0 top
SW2  68.96,25.91 0 top
TLV75533  67.31,60.71 180 top

### Tracks (layer width: path | path; a pad name or v marks a point on that pad's centre or on a via)
3V3  (2 unrouted)
  Top 0.305: 54.93,47.92 F446.1 54.93,51.63 | F446.64 58.36,48.07 58.67,48.39 58.67,49.78 59,50.11 C70.2 60.48,50.11 | R79.1 45.45,56.34 C68.2 45.45,52.34 45.72,52.07 48.22,52.07 48.93,51.36 F446.13 48.93,47.1 48.9,47.07 | F446.32 | C66.2 54.15,35.63 54.93,36.4 F446.48 | C69.2 42.7,47.97 43.61,47.07 F446.19 46.86,47.07 | 61.46,51.09 61.45,51.08 | STLINK.1 57.64,35.53 C66.2 | 57.4,24.38 57.4,29.46 56.25,30.61 55.5,30.61 54.15,31.95 C66.2 | F446.32 47.82,40.57 47.88,40.51 | C67.2 45.64,38.59 45.48,38.75 F446.32 | 24C04.2 68.33,38.1 67.26,37.04 67.26,32.69 67.82,32.13 67.82,23.37 | C65.+ 61.46,53.84
  Top 0.406: 54.93,51.63 55.99,52.69 C71.2 60.31,52.69 61.46,53.84 | C65.+ 61.46,52.58 | 61.46,52.58 61.46,51.09 | 60.48,50.11 61.45,51.08 65.66,46.86 24C04.8 | R95.1 62.47,51.56 61.46,52.58
  Top 0.61: 54.93,47.92 54.07,47.07 51.94,47.07 | 51.94,47.07 48.9,47.07 46.86,47.07 | L1.2 61.06,55.97 C65.+ | 51.94,47.07 51.94,44.58 47.88,40.51
  Bottom 0.305: 24C04.8 65.79,49.02 R84.2 65.15,50.29 65.53,50.67 R88.2 | 24C04.8 68.33,44.32 24C04.2 24C04.3 | STLINK.1 57.59,35.62 56.01,37.21 56.01,42.67 57.53,44.2 63.12,44.2 24C04.8
5V  (14 unrouted)
+15V  (11 unrouted)
-15V  (9 unrouted)
AD5644_CLK  (via drill 0.35)
  Top 0.254: AD5644.7 34.68,45.59 v34.93,45.34 | v43.82,44.58 43.82,42.54 44.29,42.07 F446.29
  Bottom 0.254: v34.93,45.34 35.18,45.09 43.56,45.09 43.82,44.83 v43.82,44.58
AD5644_DI  (via drill 0.35)
  Top 0.254: v50.93,47.88 F446.9
  Top 0.305: AD5644.8 35.18,46.1 35.43,45.85 37.47,45.85 38.23,46.61 38.23,48.39 v38.73,48.89
  Bottom 0.254: v38.73,48.89 41.28,48.89 44.07,48.89 45.59,47.37 50.42,47.37 v50.93,47.88
AD5644_SYNC
  Top 0.254: F446.33 47.43,34.42 46.41,33.4 44.58,33.4 | AD5644.6 34.18,44.83 34.69,44.32 36.96,44.32 39.75,41.53 39.75,34.16
  Top 0.305: 44.58,33.4 43.18,32 40.13,32 39.75,32.38 39.75,34.16
BH2221_AO1
  Top 0.254: BH2221.18 37.57,22.63 36.96,23.24 A02/1/12/11.2
BH2221_AO2
  Top 0.254: BH2221.19 38.75,21.98 37.47,20.7 A02/1/12/11.1
BH2221_AO3
  Top 0.254: A010/9/8/7/3/4/5/6.5 49.4,16.89 49.24,17.05 49.24,21.65 49.57,21.98 BH2221.2
BH2221_AO4
  Top 0.254: BH2221.3 51.37,22.63 51.94,22.05 A010/9/8/7/3/4/5/6.6
BH2221_AO6
  Top 0.254: BH2221.5 51.46,23.93 57.02,18.37 A010/9/8/7/3/4/5/6.8
BH2221_AO7
  Top 0.254: BH2221.6 49.57,24.58 48.82,23.83 48.82,22.4 46.86,20.45 A010/9/8/7/3/4/5/6.4
BH2221_AO8
  Top 0.254: BH2221.7 49.57,25.23 46.33,21.99 46.33,20.17 44.32,18.16 A010/9/8/7/3/4/5/6.3
BH2221_AO9
  Top 0.254: BH2221.8 49.57,25.88 45.63,21.94 45.63,20.73 41.78,16.89 A010/9/8/7/3/4/5/6.2
BH2221_AO10
  Top 0.254: BH2221.9 49.57,26.53 45.02,21.98 45.02,21.34 42.68,19.01 41.36,19.01 39.24,16.89 A010/9/8/7/3/4/5/6.1
BH2221_AO11
  Top 0.254: BH2221.12 38.75,26.53 36.96,28.32 A02/1/12/11.4
BH2221_AO12
  Top 0.254: BH2221.13 37.57,25.88 37.47,25.78 A02/1/12/11.3
BH2221_CLK  (via drill 0.35)
  Top 0.254: BH2221.16 44.76,23.93 47.12,26.29 v47.12,26.8 | v46.86,45.85 46.64,46.07 F446.21
  Bottom 0.254: v46.86,45.85 47.12,45.59 47.12,44.83 | 47.12,36.45 v47.12,26.8
  Bottom 0.305: 47.12,44.83 47.75,44.2 47.75,37.08 47.12,36.45
BH2221_DI  (via drill 0.35)
  Top 0.254: BH2221.17 45.13,23.28 v48.39,26.54 | v47.88,45.09 v47.87,45.07 F446.23
  Bottom 0.254: v47.88,45.09 48.39,44.58 v48.39,26.54
BH2221_LD  (via drill 0.35)
  Top 0.254: BH2221.15 44.39,24.58 v46.1,26.29 | F446.20 43.98,46.57 43.05,45.65 v43.05,43.81
  Bottom 0.254: v43.05,43.81 43.05,41.53 42.29,40.77 42.29,38.35 46.1,34.54 v46.1,26.29
BOOT1
  Top 0.305: R81.1 59.26,45.52 58.7,46.07 F446.60
CALIB_IN_3340A  (via drill 0.35)
  Top 0.305: F446.14 48.43,48.43 v48.13,48.13
  Bottom 0.305: v48.13,48.13 49.66,48.13 50.42,48.89 50.42,56.01 49.4,57.02 48.39,57.02 46.86,58.55 46.86,64.01 49.15,66.29 49.15,69.09 47.5,70.74 CAL_IN_A.P$1
CALIB_IN_3340B  (via drill 0.35)
  Top 0.305: v44.83,51.82 45.21,51.43 47.35,51.43 47.93,50.85 F446.15
  Bottom 0.305: v44.83,51.82 44.83,53.21 45.09,53.47 48.13,53.47 48.64,53.97 48.64,54.99 45.85,57.78 45.85,65.66 CAL_IN_B.P$1
EXT1
  Top 0.254: F446.50 60.5,41.07 61.57,40 61.57,35.02 EXT.1
EXT2
  Top 0.254: EXT.2 60.58,31.54 63.98,34.94 63.98,38.98 61.38,41.57 F446.51
EXT3
  Top 0.254: EXT.3 63.12,32.64 64.38,33.9 64.38,39.4 61.71,42.07 F446.52
EXT4
  Top 0.254: F446.53 62.16,42.57 64.79,39.95 64.79,33.89 65.66,33.02 EXT.4
GND  (65 unrouted)
LED1_PWM  (via drill 0.35)
  Top 0.305: F446.22 44.09,45.57 v43.94,45.72 | v41.4,49.66 42.42,50.67 R90.1
  Bottom 0.305: v43.94,45.72 38.99,45.72 37.97,46.74 37.97,49.02 38.61,49.66 v41.4,49.66
LED2_PWM
  Top 0.305: F446.38 49.93,35.89 R89.1
LED3_PWM  (via drill 0.35)
  Top 0.305: F446.26 46.72,43.57 v46.99,43.31 | v43.32,39.67 42.57,38.92 R91.1
  Bottom 0.305: v46.99,43.31 43.35,39.67 v43.32,39.67
N$5  (via drill 0.35)
  Top 0.305: SW2.4 73.53,22.33 73.53,18.42 73.02,17.91 69.47,17.91 68.96,18.42 R85.1 R82.2 v65.53,19.56
  Bottom 0.305: v65.53,19.56 64.77,20.32 64.77,22.71 SW2.3
N$7  (via drill 0.35)
  Top 0.305: v55.15,21.36 56.52,21.36 R83.2 R86.1 | SW1.3 SW1.4
  Bottom 0.305: SW1.3 55.17,21.37 v55.15,21.36
N$23
  Top 0.254: BH2221.4 51.37,23.28 54.48,20.17 A010/9/8/7/3/4/5/6.7
N$34
  Top 0.254: AD5644.1 36.18,52.94 37.97,54.74 37.97,62.86 36.45,64.39 ABCD.1
N$35
  Top 0.254: ABCD.2 35.94,61.85 37.11,60.68 37.11,55.33 35.68,53.9 AD5644.2
N$39
  Top 0.254: AD5644.4 34.68,54.24 36.45,56.01 36.45,58.29 35.43,59.31 ABCD.3
N$40
  Top 0.254: AD5644.5 34.18,56.53 ABCD.4
N$48
  Top 0.305: R89.2 50.93,32.96 RED1.A
N$52
  Top 0.305: R91.2 RED2.A
N$53
  Top 0.305: R92.2 87.7,85.79 88.9,84.58 89.53,84.58 89.6,84.52 5V.A
N$54
  Top 0.305: -15V.C 92.04,83.91 93.91,85.79 R93.2
N$55
  Top 0.305: R94.2 98.23,85.66 96.77,84.2 96.52,84.2 96.36,84.04 +15V.A
N$56
  Top 0.305: R90.2 41.97,53.15 41.15,52.32 41.15,51.43 40.86,51.15 GREEN.A
N$57
  Top 0.406: R95.2 3V3.A
N$58  (via drill 0.35)
  Top 0.254: F446.16 45.61,50.02 44.07,51.56 44.07,56.9 v43.56,57.4
  Bottom 0.254: v43.56,57.4 43.69,57.53 44.32,57.53 45.09,58.29 45.09,64.9 43.43,66.55 ANAIN.2
N$59
  Top 0.254: 38.83,59.09 38.83,62.27 | 41.29,56.63 43.49,54.43 43.49,50.7 45.48,48.71 F446.17
  Top 0.305: 41.29,56.63 39.77,56.63 38.83,57.57 38.83,59.09 | 38.83,62.27 38.83,66.07 ANAIN.1
N$104
  Top 0.254: R80.2 55.69,54.12
  Top 0.406: C56.2 Q1.1 55.69,54.12
N$108
  Top 0.61: TLV75533.5 63.77,59.76 R87.2
N$109
  Top 0.813: R87.1 L1.1
NRST
  Top 0.305: RST.1 48.84,58.95 | 48.84,58.95 47.3,57.41 R79.2 48.32,56.39 49.02,55.69 49.02,53.5 49.77,52.75 C55.2 51.39,52.75 51.94,52.2 51.93,52.18 F446.7 | RST.2 48.84,58.95
  Bottom 0.305: RST.1 54.18,54.38 54.18,37.04 57.17,34.05 58.7,34.05 STLINK.3
OSC_IN
  Top 0.305: R80.1 53.74,52.98 52.93,52.17 F446.5
OSC_OUT
  Top 0.254: Q1.2 52.44,56.82
  Top 0.305: 52.44,56.82 52.43,56.81 F446.6
  Top 0.406: Q1.2 C57.2
SCL  (via drill 0.35)
  Top 0.305: 69.47,42.04 v69.98,42.54 | 69.47,42.04 68.96,42.04 65.68,42.04 61.14,46.57 F446.61 | I2C.2 69.6,35.43 69.6,42.04 69.47,42.04
  Bottom 0.305: v69.98,42.54 70.87,43.43 24C04.6 68.07,49.66 R84.1
SDA
  Top 0.305: 70.55,44.01 24C04.5 | I2C.1 72.14,35.43 72.14,42.42 70.55,44.01 | F446.62 61.52,47.07 64.59,44.01 70.55,44.01
  Bottom 0.305: R88.1 73.41,50.04 24C04.5
SW1  (via drill 0.35)  (1 unrouted)
  Top 0.305: v51.56,40.77 50.93,40.14 F446.40 | v68.96,23.68 R85.2 69.21,21.34
  Bottom 0.305: v51.56,40.77 51.56,29 54.15,26.42 66.22,26.42 v68.96,23.68
SW2  (via drill 0.35)  (1 unrouted)
  Top 0.305: C64.1 R86.2 | v50.42,40.77 50.42,38.63 F446.39
  Bottom 0.305: v50.42,40.77 50.42,28.58 53.85,25.15 58.55,25.15 59.31,24.38
SWCLK
  Top 0.305: F446.49 59.63,40.57 60.27,39.93 STLINK.4
SWDIO
  Top 0.305: STLINK.2 57.48,38.16 55.59,40.06 54.28,40.06 53.93,39.7 F446.46
USART1_RX  (via drill 0.35)
  Top 0.305: F446.59 55.39,45.57 v54.99,45.97
  Bottom 0.305: v54.99,45.97 71.5,62.48 MIDI.1
USART1_TX  (via drill 0.35)
  Top 0.305: F446.58 v58.41,45.07 v58.42,45.09
  Bottom 0.305: v58.42,45.09 73.28,59.94 MIDI.2
VCAP1
  Top 0.305: F446.30 43.96,41.57 42.28,43.25 C60.2

### Text on the board
tNames: SYD.X.REY / INSTR. / 2020